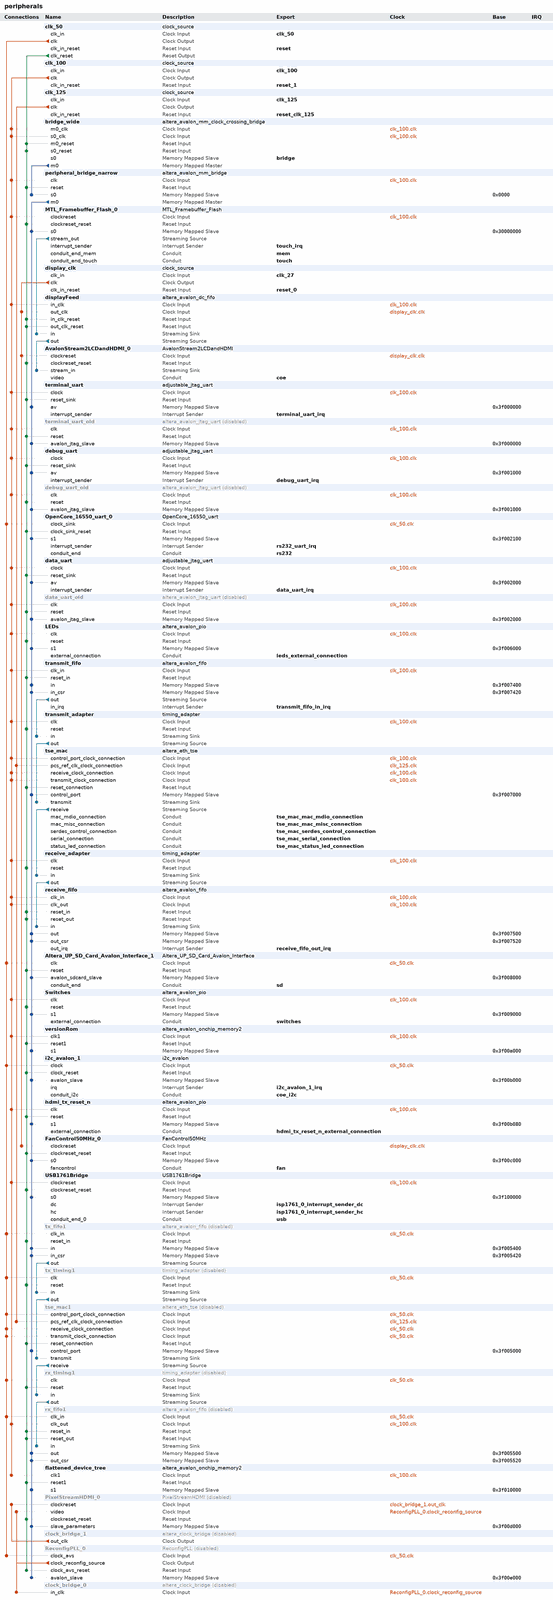
[diagram p0: system contents, whole]
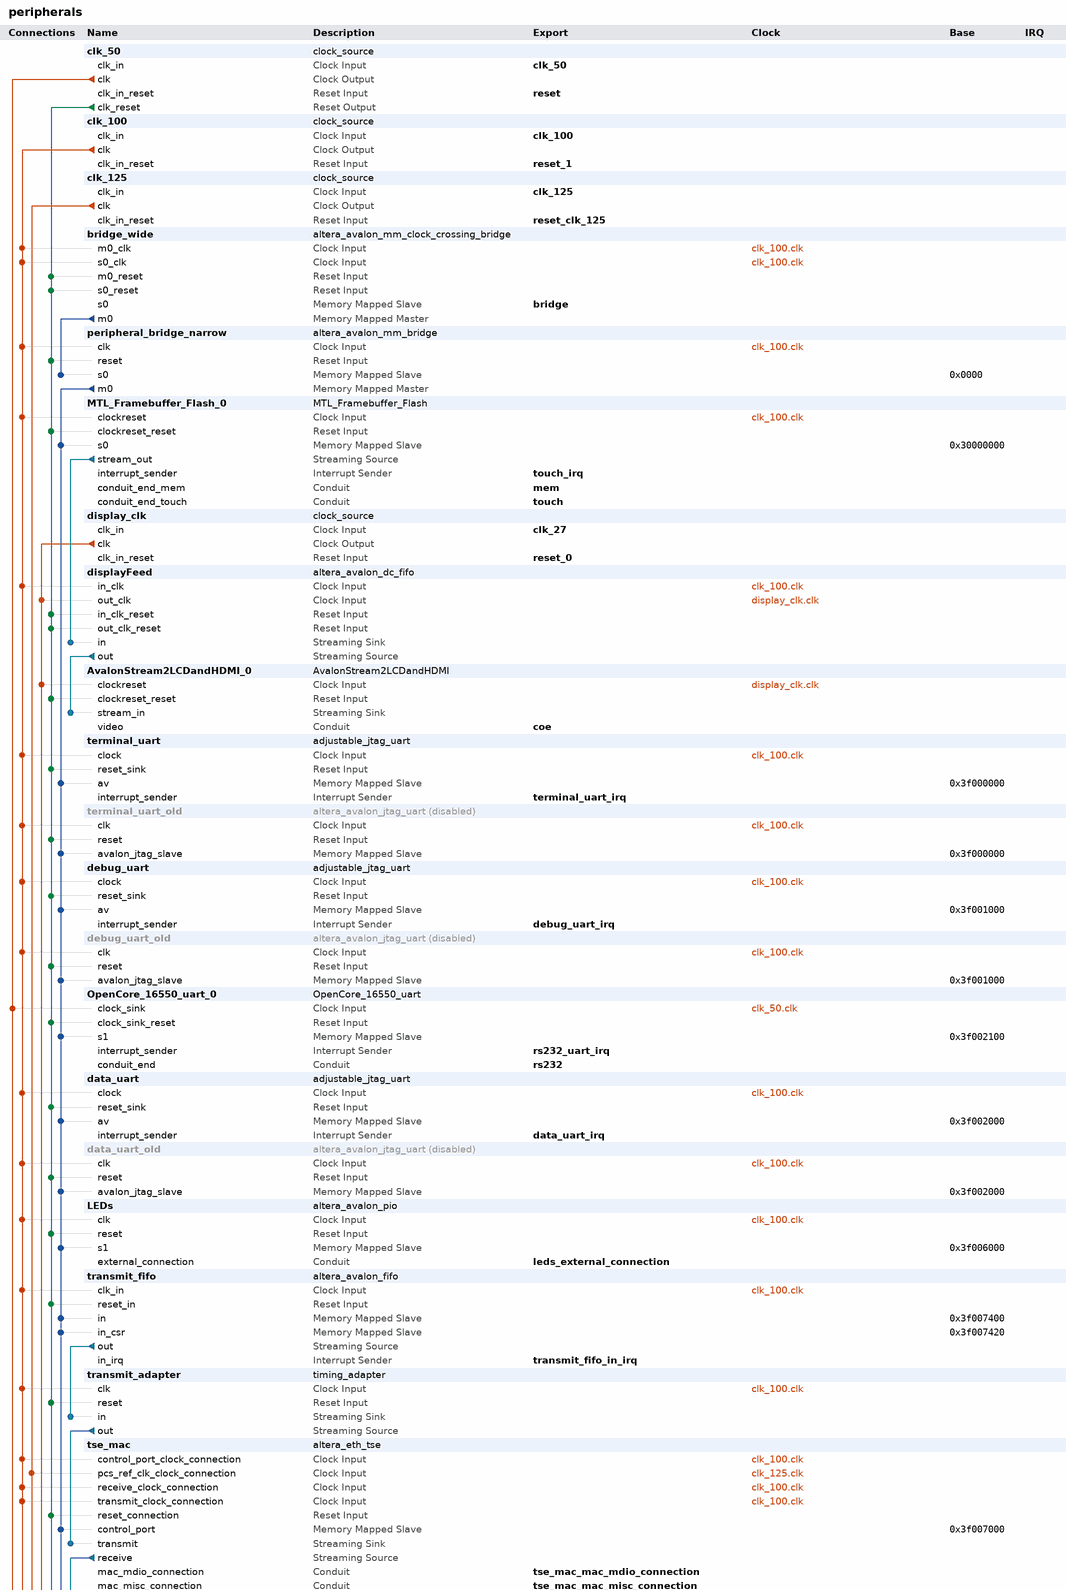
[diagram p1: system contents, upper part]
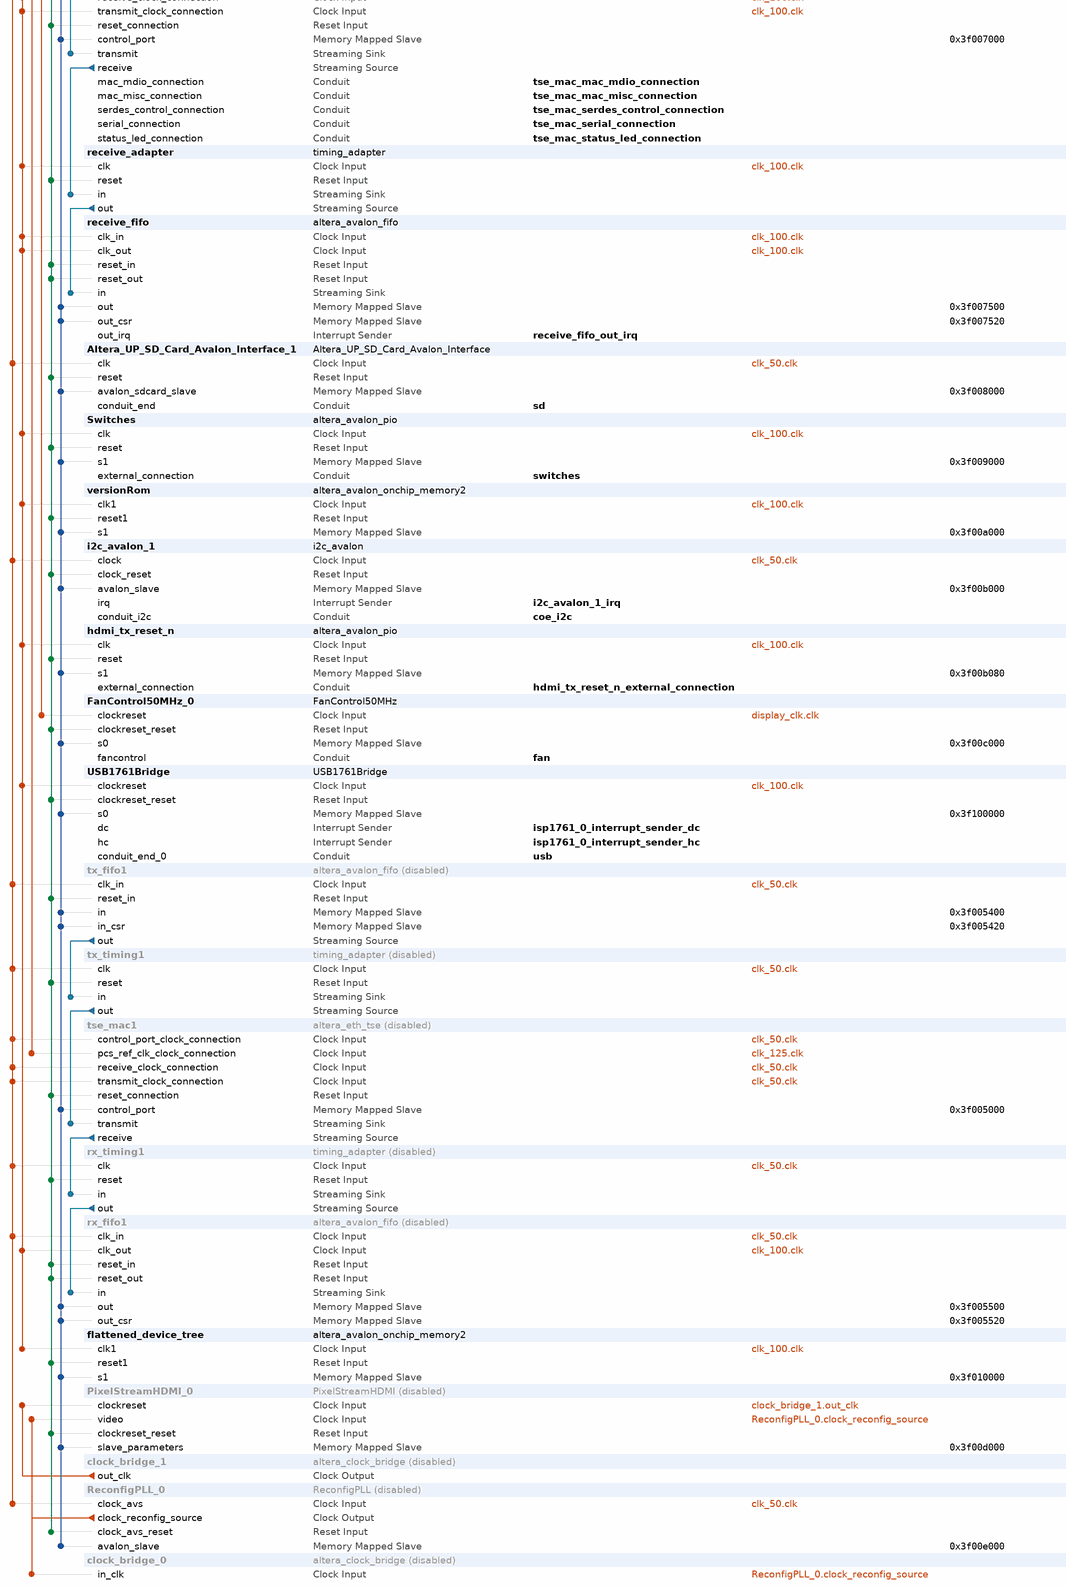
[diagram p2: system contents, lower part]
# Platform Designer (Qsys) system peripherals, Stratix IV EP4SGX230KF40C2
# Parameters at their usual value, and those the tool derives, are not listed.
package require -exact qsys 16.0
create_system peripherals
set_project_property DEVICE_FAMILY {Stratix IV}
set_project_property DEVICE EP4SGX230KF40C2

add_instance clk_50 clock_source 16.0
set_instance_parameter_value clk_50 clockFrequency 50000000

add_instance clk_100 clock_source 16.0
set_instance_parameter_value clk_100 clockFrequency 100000000

add_instance clk_125 clock_source 16.0
set_instance_parameter_value clk_125 clockFrequency 125000000

add_instance bridge_wide altera_avalon_mm_clock_crossing_bridge 16.0
set_instance_parameter_value bridge_wide ADDRESS_WIDTH 30
set_instance_parameter_value bridge_wide COMMAND_FIFO_DEPTH 4
set_instance_parameter_value bridge_wide DATA_WIDTH 256
set_instance_parameter_value bridge_wide MASTER_SYNC_DEPTH 2
set_instance_parameter_value bridge_wide MAX_BURST_SIZE 8
set_instance_parameter_value bridge_wide RESPONSE_FIFO_DEPTH 16
set_instance_parameter_value bridge_wide SLAVE_SYNC_DEPTH 2
set_instance_parameter_value bridge_wide USE_AUTO_ADDRESS_WIDTH 0

add_instance peripheral_bridge_narrow altera_avalon_mm_bridge 16.0
set_instance_parameter_value peripheral_bridge_narrow ADDRESS_UNITS SYMBOLS
set_instance_parameter_value peripheral_bridge_narrow ADDRESS_WIDTH 30
set_instance_parameter_value peripheral_bridge_narrow DATA_WIDTH 32
set_instance_parameter_value peripheral_bridge_narrow MAX_PENDING_RESPONSES 1
set_instance_parameter_value peripheral_bridge_narrow USE_AUTO_ADDRESS_WIDTH 0

add_instance MTL_Framebuffer_Flash_0 MTL_Framebuffer_Flash 1.0

add_instance display_clk clock_source 16.0
set_instance_parameter_value display_clk clockFrequency 27000000

add_instance displayFeed altera_avalon_dc_fifo 16.0
set_instance_parameter_value displayFeed BITS_PER_SYMBOL 24
set_instance_parameter_value displayFeed FIFO_DEPTH 32
set_instance_parameter_value displayFeed RD_SYNC_DEPTH 2
set_instance_parameter_value displayFeed USE_PACKETS 1
set_instance_parameter_value displayFeed WR_SYNC_DEPTH 2

add_instance AvalonStream2LCDandHDMI_0 AvalonStream2LCDandHDMI 1.0

add_instance terminal_uart adjustable_jtag_uart 13.1
set_instance_parameter_value terminal_uart INSTANCE_ID 1
set_instance_parameter_value terminal_uart LOG2_RXFIFO_DEPTH 9
set_instance_parameter_value terminal_uart LOG2_TXFIFO_DEPTH 12
set_instance_parameter_value terminal_uart SLD_AUTO_INSTANCE_INDEX NO

add_instance terminal_uart_old altera_avalon_jtag_uart 16.0
set_instance_property terminal_uart_old ENABLED false
set_instance_parameter_value terminal_uart_old readBufferDepth 4096
set_instance_parameter_value terminal_uart_old simInteractiveOptions INTERACTIVE_ASCII_OUTPUT
set_instance_parameter_value terminal_uart_old writeBufferDepth 512

add_instance debug_uart adjustable_jtag_uart 13.1
set_instance_parameter_value debug_uart INSTANCE_ID 2
set_instance_parameter_value debug_uart LOG2_RXFIFO_DEPTH 9
set_instance_parameter_value debug_uart LOG2_TXFIFO_DEPTH 12
set_instance_parameter_value debug_uart SLD_AUTO_INSTANCE_INDEX NO

add_instance debug_uart_old altera_avalon_jtag_uart 16.0
set_instance_property debug_uart_old ENABLED false
set_instance_parameter_value debug_uart_old readBufferDepth 4096
set_instance_parameter_value debug_uart_old simInteractiveOptions INTERACTIVE_ASCII_OUTPUT
set_instance_parameter_value debug_uart_old writeBufferDepth 512

add_instance OpenCore_16550_uart_0 OpenCore_16550_uart 12.1

add_instance data_uart adjustable_jtag_uart 13.1
set_instance_parameter_value data_uart INSTANCE_ID 3
set_instance_parameter_value data_uart LOG2_RXFIFO_DEPTH 9
set_instance_parameter_value data_uart LOG2_TXFIFO_DEPTH 12
set_instance_parameter_value data_uart SLD_AUTO_INSTANCE_INDEX NO

add_instance data_uart_old altera_avalon_jtag_uart 16.0
set_instance_property data_uart_old ENABLED false
set_instance_parameter_value data_uart_old readBufferDepth 4096
set_instance_parameter_value data_uart_old simInteractiveOptions INTERACTIVE_ASCII_OUTPUT
set_instance_parameter_value data_uart_old writeBufferDepth 512

add_instance LEDs altera_avalon_pio 16.0
set_instance_parameter_value LEDs direction Output
set_instance_parameter_value LEDs width 8

add_instance transmit_fifo altera_avalon_fifo 16.0
set_instance_parameter_value transmit_fifo bitsPerSymbol 8
set_instance_parameter_value transmit_fifo channelWidth 0
set_instance_parameter_value transmit_fifo errorWidth 1
set_instance_parameter_value transmit_fifo fifoDepth 16
set_instance_parameter_value transmit_fifo fifoInputInterfaceOptions AVALONMM_WRITE
set_instance_parameter_value transmit_fifo fifoOutputInterfaceOptions AVALONST_SOURCE
set_instance_parameter_value transmit_fifo singleClockMode true
set_instance_parameter_value transmit_fifo symbolsPerBeat 4
set_instance_parameter_value transmit_fifo useIRQ true
set_instance_parameter_value transmit_fifo usePacket true
set_instance_parameter_value transmit_fifo useReadControl false

add_instance transmit_adapter timing_adapter 16.0
set_instance_parameter_value transmit_adapter inBitsPerSymbol 8
set_instance_parameter_value transmit_adapter inChannelWidth 0
set_instance_parameter_value transmit_adapter inErrorWidth 1
set_instance_parameter_value transmit_adapter inMaxChannel 0
set_instance_parameter_value transmit_adapter inReadyLatency 1
set_instance_parameter_value transmit_adapter inSymbolsPerBeat 4
set_instance_parameter_value transmit_adapter inUseEmptyPort YES
set_instance_parameter_value transmit_adapter inUsePackets true
set_instance_parameter_value transmit_adapter inUseReady true
set_instance_parameter_value transmit_adapter inUseValid true
set_instance_parameter_value transmit_adapter outReadyLatency 0
set_instance_parameter_value transmit_adapter outUseReady true
set_instance_parameter_value transmit_adapter outUseValid true

add_instance tse_mac altera_eth_tse 16.0
set_instance_parameter_value tse_mac core_variation MAC_PCS
set_instance_parameter_value tse_mac ena_hash true
set_instance_parameter_value tse_mac enable_gmii_loopback true
set_instance_parameter_value tse_mac enable_hd_logic true
set_instance_parameter_value tse_mac enable_mac_flow_ctrl true
set_instance_parameter_value tse_mac enable_mac_vlan true
set_instance_parameter_value tse_mac enable_magic_detect true
set_instance_parameter_value tse_mac enable_sgmii true
set_instance_parameter_value tse_mac enable_shift16 true
set_instance_parameter_value tse_mac enable_sup_addr true
set_instance_parameter_value tse_mac ext_stat_cnt_ena true
set_instance_parameter_value tse_mac ifGMII MII_GMII
set_instance_parameter_value tse_mac ing_addr 11
set_instance_parameter_value tse_mac mdio_clk_div 40
set_instance_parameter_value tse_mac phy_identifier 213975361
set_instance_parameter_value tse_mac stat_cnt_ena true
set_instance_parameter_value tse_mac transceiver_type LVDS_IO

add_instance receive_adapter timing_adapter 16.0
set_instance_parameter_value receive_adapter inBitsPerSymbol 8
set_instance_parameter_value receive_adapter inChannelWidth 0
set_instance_parameter_value receive_adapter inErrorWidth 6
set_instance_parameter_value receive_adapter inMaxChannel 0
set_instance_parameter_value receive_adapter inReadyLatency 0
set_instance_parameter_value receive_adapter inSymbolsPerBeat 4
set_instance_parameter_value receive_adapter inUseEmptyPort YES
set_instance_parameter_value receive_adapter inUsePackets true
set_instance_parameter_value receive_adapter inUseReady true
set_instance_parameter_value receive_adapter inUseValid true
set_instance_parameter_value receive_adapter outReadyLatency 1
set_instance_parameter_value receive_adapter outUseReady true
set_instance_parameter_value receive_adapter outUseValid true

add_instance receive_fifo altera_avalon_fifo 16.0
set_instance_parameter_value receive_fifo bitsPerSymbol 8
set_instance_parameter_value receive_fifo channelWidth 0
set_instance_parameter_value receive_fifo errorWidth 6
set_instance_parameter_value receive_fifo fifoDepth 16
set_instance_parameter_value receive_fifo fifoInputInterfaceOptions AVALONST_SINK
set_instance_parameter_value receive_fifo fifoOutputInterfaceOptions AVALONMM_READ
set_instance_parameter_value receive_fifo singleClockMode false
set_instance_parameter_value receive_fifo symbolsPerBeat 4
set_instance_parameter_value receive_fifo useIRQ true
set_instance_parameter_value receive_fifo usePacket true
set_instance_parameter_value receive_fifo useReadControl true
set_instance_parameter_value receive_fifo useWriteControl false

add_instance Altera_UP_SD_Card_Avalon_Interface_1 Altera_UP_SD_Card_Avalon_Interface 15.1

add_instance Switches altera_avalon_pio 16.0
set_instance_parameter_value Switches direction Input
set_instance_parameter_value Switches width 16

add_instance versionRom altera_avalon_onchip_memory2 16.0
set_instance_parameter_value versionRom dataWidth 32
set_instance_parameter_value versionRom dualPort false
set_instance_parameter_value versionRom initMemContent true
set_instance_parameter_value versionRom initializationFileName version
set_instance_parameter_value versionRom memorySize 1024
set_instance_parameter_value versionRom useNonDefaultInitFile true
set_instance_parameter_value versionRom writable false

add_instance i2c_avalon_1 i2c_avalon 1.0

add_instance hdmi_tx_reset_n altera_avalon_pio 16.0
set_instance_parameter_value hdmi_tx_reset_n direction Output
set_instance_parameter_value hdmi_tx_reset_n width 1

add_instance FanControl50MHz_0 FanControl50MHz 1.0

add_instance USB1761Bridge USB1761Bridge 1.0

add_instance tx_fifo1 altera_avalon_fifo 16.0
set_instance_property tx_fifo1 ENABLED false
set_instance_parameter_value tx_fifo1 bitsPerSymbol 8
set_instance_parameter_value tx_fifo1 channelWidth 0
set_instance_parameter_value tx_fifo1 errorWidth 1
set_instance_parameter_value tx_fifo1 fifoDepth 16
set_instance_parameter_value tx_fifo1 fifoInputInterfaceOptions AVALONMM_WRITE
set_instance_parameter_value tx_fifo1 fifoOutputInterfaceOptions AVALONST_SOURCE
set_instance_parameter_value tx_fifo1 singleClockMode true
set_instance_parameter_value tx_fifo1 symbolsPerBeat 4
set_instance_parameter_value tx_fifo1 useIRQ true
set_instance_parameter_value tx_fifo1 usePacket true
set_instance_parameter_value tx_fifo1 useReadControl false

add_instance tx_timing1 timing_adapter 16.0
set_instance_property tx_timing1 ENABLED false
set_instance_parameter_value tx_timing1 inBitsPerSymbol 8
set_instance_parameter_value tx_timing1 inChannelWidth 0
set_instance_parameter_value tx_timing1 inErrorWidth 1
set_instance_parameter_value tx_timing1 inMaxChannel 0
set_instance_parameter_value tx_timing1 inReadyLatency 1
set_instance_parameter_value tx_timing1 inSymbolsPerBeat 4
set_instance_parameter_value tx_timing1 inUseEmptyPort YES
set_instance_parameter_value tx_timing1 inUsePackets true
set_instance_parameter_value tx_timing1 inUseReady true
set_instance_parameter_value tx_timing1 inUseValid true
set_instance_parameter_value tx_timing1 outReadyLatency 0
set_instance_parameter_value tx_timing1 outUseReady true
set_instance_parameter_value tx_timing1 outUseValid true

add_instance tse_mac1 altera_eth_tse 16.0
set_instance_property tse_mac1 ENABLED false
set_instance_parameter_value tse_mac1 core_variation MAC_PCS
set_instance_parameter_value tse_mac1 ena_hash true
set_instance_parameter_value tse_mac1 enable_gmii_loopback true
set_instance_parameter_value tse_mac1 enable_hd_logic true
set_instance_parameter_value tse_mac1 enable_mac_flow_ctrl true
set_instance_parameter_value tse_mac1 enable_mac_vlan true
set_instance_parameter_value tse_mac1 enable_magic_detect true
set_instance_parameter_value tse_mac1 enable_sgmii true
set_instance_parameter_value tse_mac1 enable_shift16 true
set_instance_parameter_value tse_mac1 enable_sup_addr true
set_instance_parameter_value tse_mac1 ext_stat_cnt_ena true
set_instance_parameter_value tse_mac1 ifGMII MII_GMII
set_instance_parameter_value tse_mac1 ing_addr 11
set_instance_parameter_value tse_mac1 mdio_clk_div 40
set_instance_parameter_value tse_mac1 phy_identifier 213975361
set_instance_parameter_value tse_mac1 stat_cnt_ena true
set_instance_parameter_value tse_mac1 transceiver_type LVDS_IO

add_instance rx_timing1 timing_adapter 16.0
set_instance_property rx_timing1 ENABLED false
set_instance_parameter_value rx_timing1 inBitsPerSymbol 8
set_instance_parameter_value rx_timing1 inChannelWidth 0
set_instance_parameter_value rx_timing1 inErrorWidth 6
set_instance_parameter_value rx_timing1 inMaxChannel 0
set_instance_parameter_value rx_timing1 inReadyLatency 0
set_instance_parameter_value rx_timing1 inSymbolsPerBeat 4
set_instance_parameter_value rx_timing1 inUseEmptyPort YES
set_instance_parameter_value rx_timing1 inUsePackets true
set_instance_parameter_value rx_timing1 inUseReady true
set_instance_parameter_value rx_timing1 inUseValid true
set_instance_parameter_value rx_timing1 outReadyLatency 1
set_instance_parameter_value rx_timing1 outUseReady true
set_instance_parameter_value rx_timing1 outUseValid true

add_instance rx_fifo1 altera_avalon_fifo 16.0
set_instance_property rx_fifo1 ENABLED false
set_instance_parameter_value rx_fifo1 bitsPerSymbol 8
set_instance_parameter_value rx_fifo1 channelWidth 0
set_instance_parameter_value rx_fifo1 errorWidth 6
set_instance_parameter_value rx_fifo1 fifoDepth 16
set_instance_parameter_value rx_fifo1 fifoInputInterfaceOptions AVALONST_SINK
set_instance_parameter_value rx_fifo1 fifoOutputInterfaceOptions AVALONMM_READ
set_instance_parameter_value rx_fifo1 singleClockMode false
set_instance_parameter_value rx_fifo1 symbolsPerBeat 4
set_instance_parameter_value rx_fifo1 useIRQ true
set_instance_parameter_value rx_fifo1 usePacket true
set_instance_parameter_value rx_fifo1 useReadControl true
set_instance_parameter_value rx_fifo1 useWriteControl false

add_instance flattened_device_tree altera_avalon_onchip_memory2 16.0
set_instance_parameter_value flattened_device_tree dataWidth 32
set_instance_parameter_value flattened_device_tree dualPort false
set_instance_parameter_value flattened_device_tree initMemContent true
set_instance_parameter_value flattened_device_tree initializationFileName dtb.hex
set_instance_parameter_value flattened_device_tree memorySize 8192
set_instance_parameter_value flattened_device_tree slave1Latency 2
set_instance_parameter_value flattened_device_tree useNonDefaultInitFile true
set_instance_parameter_value flattened_device_tree writable false

add_instance PixelStreamHDMI_0 PixelStreamHDMI 1.0
set_instance_property PixelStreamHDMI_0 ENABLED false

add_instance clock_bridge_1 altera_clock_bridge 16.0
set_instance_property clock_bridge_1 ENABLED false
set_instance_parameter_value clock_bridge_1 DERIVED_CLOCK_RATE 0
set_instance_parameter_value clock_bridge_1 EXPLICIT_CLOCK_RATE 0

add_instance ReconfigPLL_0 ReconfigPLL 1.0
set_instance_property ReconfigPLL_0 ENABLED false

add_instance clock_bridge_0 altera_clock_bridge 16.0
set_instance_property clock_bridge_0 ENABLED false
set_instance_parameter_value clock_bridge_0 DERIVED_CLOCK_RATE 0
set_instance_parameter_value clock_bridge_0 EXPLICIT_CLOCK_RATE 0

# connections
add_connection clk_50.clk Altera_UP_SD_Card_Avalon_Interface_1.clk clock
add_connection clk_50.clk i2c_avalon_1.clock clock
add_connection clk_50.clk OpenCore_16550_uart_0.clock_sink clock
add_connection clk_50.clk ReconfigPLL_0.clock_avs clock
add_connection clk_50.clk rx_fifo1.clk_in clock
add_connection clk_50.clk rx_timing1.clk clock
add_connection clk_50.clk tse_mac1.control_port_clock_connection clock
add_connection clk_50.clk tse_mac1.receive_clock_connection clock
add_connection clk_50.clk tse_mac1.transmit_clock_connection clock
add_connection clk_50.clk tx_fifo1.clk_in clock
add_connection clk_50.clk tx_timing1.clk clock
add_connection clk_100.clk bridge_wide.m0_clk clock
add_connection clk_100.clk bridge_wide.s0_clk clock
add_connection clk_100.clk data_uart.clock clock
add_connection clk_100.clk data_uart_old.clk clock
add_connection clk_100.clk debug_uart.clock clock
add_connection clk_100.clk debug_uart_old.clk clock
add_connection clk_100.clk displayFeed.in_clk clock
add_connection clk_100.clk flattened_device_tree.clk1 clock
add_connection clk_100.clk hdmi_tx_reset_n.clk clock
add_connection clk_100.clk LEDs.clk clock
add_connection clk_100.clk MTL_Framebuffer_Flash_0.clockreset clock
add_connection clk_100.clk peripheral_bridge_narrow.clk clock
add_connection clk_100.clk receive_adapter.clk clock
add_connection clk_100.clk receive_fifo.clk_in clock
add_connection clk_100.clk receive_fifo.clk_out clock
add_connection clk_100.clk rx_fifo1.clk_out clock
add_connection clk_100.clk Switches.clk clock
add_connection clk_100.clk terminal_uart.clock clock
add_connection clk_100.clk terminal_uart_old.clk clock
add_connection clk_100.clk transmit_adapter.clk clock
add_connection clk_100.clk transmit_fifo.clk_in clock
add_connection clk_100.clk tse_mac.control_port_clock_connection clock
add_connection clk_100.clk tse_mac.receive_clock_connection clock
add_connection clk_100.clk tse_mac.transmit_clock_connection clock
add_connection clk_100.clk USB1761Bridge.clockreset clock
add_connection clk_100.clk versionRom.clk1 clock
add_connection clk_125.clk tse_mac1.pcs_ref_clk_clock_connection clock
add_connection clk_125.clk tse_mac.pcs_ref_clk_clock_connection clock
add_connection clock_bridge_1.out_clk PixelStreamHDMI_0.clockreset clock
add_connection display_clk.clk AvalonStream2LCDandHDMI_0.clockreset clock
add_connection display_clk.clk displayFeed.out_clk clock
add_connection display_clk.clk FanControl50MHz_0.clockreset clock
add_connection ReconfigPLL_0.clock_reconfig_source clock_bridge_0.in_clk clock
add_connection ReconfigPLL_0.clock_reconfig_source PixelStreamHDMI_0.video clock
add_connection clk_50.clk_reset Altera_UP_SD_Card_Avalon_Interface_1.reset reset
add_connection clk_50.clk_reset AvalonStream2LCDandHDMI_0.clockreset_reset reset
add_connection clk_50.clk_reset bridge_wide.m0_reset reset
add_connection clk_50.clk_reset bridge_wide.s0_reset reset
add_connection clk_50.clk_reset data_uart.reset_sink reset
add_connection clk_50.clk_reset data_uart_old.reset reset
add_connection clk_50.clk_reset debug_uart.reset_sink reset
add_connection clk_50.clk_reset debug_uart_old.reset reset
add_connection clk_50.clk_reset displayFeed.in_clk_reset reset
add_connection clk_50.clk_reset displayFeed.out_clk_reset reset
add_connection clk_50.clk_reset FanControl50MHz_0.clockreset_reset reset
add_connection clk_50.clk_reset flattened_device_tree.reset1 reset
add_connection clk_50.clk_reset hdmi_tx_reset_n.reset reset
add_connection clk_50.clk_reset i2c_avalon_1.clock_reset reset
add_connection clk_50.clk_reset LEDs.reset reset
add_connection clk_50.clk_reset MTL_Framebuffer_Flash_0.clockreset_reset reset
add_connection clk_50.clk_reset OpenCore_16550_uart_0.clock_sink_reset reset
add_connection clk_50.clk_reset peripheral_bridge_narrow.reset reset
add_connection clk_50.clk_reset PixelStreamHDMI_0.clockreset_reset reset
add_connection clk_50.clk_reset receive_adapter.reset reset
add_connection clk_50.clk_reset receive_fifo.reset_in reset
add_connection clk_50.clk_reset receive_fifo.reset_out reset
add_connection clk_50.clk_reset ReconfigPLL_0.clock_avs_reset reset
add_connection clk_50.clk_reset rx_fifo1.reset_in reset
add_connection clk_50.clk_reset rx_fifo1.reset_out reset
add_connection clk_50.clk_reset rx_timing1.reset reset
add_connection clk_50.clk_reset Switches.reset reset
add_connection clk_50.clk_reset terminal_uart.reset_sink reset
add_connection clk_50.clk_reset terminal_uart_old.reset reset
add_connection clk_50.clk_reset transmit_adapter.reset reset
add_connection clk_50.clk_reset transmit_fifo.reset_in reset
add_connection clk_50.clk_reset tse_mac1.reset_connection reset
add_connection clk_50.clk_reset tse_mac.reset_connection reset
add_connection clk_50.clk_reset tx_fifo1.reset_in reset
add_connection clk_50.clk_reset tx_timing1.reset reset
add_connection clk_50.clk_reset USB1761Bridge.clockreset_reset reset
add_connection clk_50.clk_reset versionRom.reset1 reset
add_connection bridge_wide.m0 peripheral_bridge_narrow.s0 avalon
set_connection_parameter_value bridge_wide.m0/peripheral_bridge_narrow.s0 baseAddress 0x0000
add_connection peripheral_bridge_narrow.m0 Altera_UP_SD_Card_Avalon_Interface_1.avalon_sdcard_slave avalon
set_connection_parameter_value peripheral_bridge_narrow.m0/Altera_UP_SD_Card_Avalon_Interface_1.avalon_sdcard_slave baseAddress 0x3f008000
add_connection peripheral_bridge_narrow.m0 data_uart.av avalon
set_connection_parameter_value peripheral_bridge_narrow.m0/data_uart.av baseAddress 0x3f002000
add_connection peripheral_bridge_narrow.m0 data_uart_old.avalon_jtag_slave avalon
set_connection_parameter_value peripheral_bridge_narrow.m0/data_uart_old.avalon_jtag_slave baseAddress 0x3f002000
add_connection peripheral_bridge_narrow.m0 debug_uart.av avalon
set_connection_parameter_value peripheral_bridge_narrow.m0/debug_uart.av baseAddress 0x3f001000
add_connection peripheral_bridge_narrow.m0 debug_uart_old.avalon_jtag_slave avalon
set_connection_parameter_value peripheral_bridge_narrow.m0/debug_uart_old.avalon_jtag_slave baseAddress 0x3f001000
add_connection peripheral_bridge_narrow.m0 FanControl50MHz_0.s0 avalon
set_connection_parameter_value peripheral_bridge_narrow.m0/FanControl50MHz_0.s0 baseAddress 0x3f00c000
add_connection peripheral_bridge_narrow.m0 flattened_device_tree.s1 avalon
set_connection_parameter_value peripheral_bridge_narrow.m0/flattened_device_tree.s1 baseAddress 0x3f010000
add_connection peripheral_bridge_narrow.m0 hdmi_tx_reset_n.s1 avalon
set_connection_parameter_value peripheral_bridge_narrow.m0/hdmi_tx_reset_n.s1 baseAddress 0x3f00b080
add_connection peripheral_bridge_narrow.m0 i2c_avalon_1.avalon_slave avalon
set_connection_parameter_value peripheral_bridge_narrow.m0/i2c_avalon_1.avalon_slave baseAddress 0x3f00b000
add_connection peripheral_bridge_narrow.m0 LEDs.s1 avalon
set_connection_parameter_value peripheral_bridge_narrow.m0/LEDs.s1 baseAddress 0x3f006000
add_connection peripheral_bridge_narrow.m0 MTL_Framebuffer_Flash_0.s0 avalon
set_connection_parameter_value peripheral_bridge_narrow.m0/MTL_Framebuffer_Flash_0.s0 baseAddress 0x30000000
add_connection peripheral_bridge_narrow.m0 OpenCore_16550_uart_0.s1 avalon
set_connection_parameter_value peripheral_bridge_narrow.m0/OpenCore_16550_uart_0.s1 baseAddress 0x3f002100
add_connection peripheral_bridge_narrow.m0 PixelStreamHDMI_0.slave_parameters avalon
set_connection_parameter_value peripheral_bridge_narrow.m0/PixelStreamHDMI_0.slave_parameters baseAddress 0x3f00d000
add_connection peripheral_bridge_narrow.m0 receive_fifo.out avalon
set_connection_parameter_value peripheral_bridge_narrow.m0/receive_fifo.out baseAddress 0x3f007500
add_connection peripheral_bridge_narrow.m0 receive_fifo.out_csr avalon
set_connection_parameter_value peripheral_bridge_narrow.m0/receive_fifo.out_csr baseAddress 0x3f007520
add_connection peripheral_bridge_narrow.m0 ReconfigPLL_0.avalon_slave avalon
set_connection_parameter_value peripheral_bridge_narrow.m0/ReconfigPLL_0.avalon_slave baseAddress 0x3f00e000
add_connection peripheral_bridge_narrow.m0 rx_fifo1.out avalon
set_connection_parameter_value peripheral_bridge_narrow.m0/rx_fifo1.out baseAddress 0x3f005500
add_connection peripheral_bridge_narrow.m0 rx_fifo1.out_csr avalon
set_connection_parameter_value peripheral_bridge_narrow.m0/rx_fifo1.out_csr baseAddress 0x3f005520
add_connection peripheral_bridge_narrow.m0 Switches.s1 avalon
set_connection_parameter_value peripheral_bridge_narrow.m0/Switches.s1 baseAddress 0x3f009000
add_connection peripheral_bridge_narrow.m0 terminal_uart.av avalon
set_connection_parameter_value peripheral_bridge_narrow.m0/terminal_uart.av baseAddress 0x3f000000
add_connection peripheral_bridge_narrow.m0 terminal_uart_old.avalon_jtag_slave avalon
set_connection_parameter_value peripheral_bridge_narrow.m0/terminal_uart_old.avalon_jtag_slave baseAddress 0x3f000000
add_connection peripheral_bridge_narrow.m0 transmit_fifo.in avalon
set_connection_parameter_value peripheral_bridge_narrow.m0/transmit_fifo.in baseAddress 0x3f007400
add_connection peripheral_bridge_narrow.m0 transmit_fifo.in_csr avalon
set_connection_parameter_value peripheral_bridge_narrow.m0/transmit_fifo.in_csr baseAddress 0x3f007420
add_connection peripheral_bridge_narrow.m0 tse_mac1.control_port avalon
set_connection_parameter_value peripheral_bridge_narrow.m0/tse_mac1.control_port baseAddress 0x3f005000
add_connection peripheral_bridge_narrow.m0 tse_mac.control_port avalon
set_connection_parameter_value peripheral_bridge_narrow.m0/tse_mac.control_port baseAddress 0x3f007000
add_connection peripheral_bridge_narrow.m0 tx_fifo1.in avalon
set_connection_parameter_value peripheral_bridge_narrow.m0/tx_fifo1.in baseAddress 0x3f005400
add_connection peripheral_bridge_narrow.m0 tx_fifo1.in_csr avalon
set_connection_parameter_value peripheral_bridge_narrow.m0/tx_fifo1.in_csr baseAddress 0x3f005420
add_connection peripheral_bridge_narrow.m0 USB1761Bridge.s0 avalon
set_connection_parameter_value peripheral_bridge_narrow.m0/USB1761Bridge.s0 baseAddress 0x3f100000
add_connection peripheral_bridge_narrow.m0 versionRom.s1 avalon
set_connection_parameter_value peripheral_bridge_narrow.m0/versionRom.s1 baseAddress 0x3f00a000
add_connection displayFeed.out AvalonStream2LCDandHDMI_0.stream_in avalon_streaming
add_connection MTL_Framebuffer_Flash_0.stream_out displayFeed.in avalon_streaming
add_connection receive_adapter.out receive_fifo.in avalon_streaming
add_connection rx_timing1.out rx_fifo1.in avalon_streaming
add_connection transmit_adapter.out tse_mac.transmit avalon_streaming
add_connection transmit_fifo.out transmit_adapter.in avalon_streaming
add_connection tse_mac1.receive rx_timing1.in avalon_streaming
add_connection tse_mac.receive receive_adapter.in avalon_streaming
add_connection tx_fifo1.out tx_timing1.in avalon_streaming
add_connection tx_timing1.out tse_mac1.transmit avalon_streaming

# exported interfaces
add_interface bridge avalon slave
set_interface_property bridge EXPORT_OF bridge_wide.s0
add_interface clk_100 clock sink
set_interface_property clk_100 EXPORT_OF clk_100.clk_in
add_interface clk_125 clock sink
set_interface_property clk_125 EXPORT_OF clk_125.clk_in
add_interface clk_27 clock sink
set_interface_property clk_27 EXPORT_OF display_clk.clk_in
add_interface clk_50 clock sink
set_interface_property clk_50 EXPORT_OF clk_50.clk_in
add_interface coe conduit end
set_interface_property coe EXPORT_OF AvalonStream2LCDandHDMI_0.video
add_interface coe_i2c conduit end
set_interface_property coe_i2c EXPORT_OF i2c_avalon_1.conduit_i2c
add_interface data_uart_irq interrupt sender
set_interface_property data_uart_irq EXPORT_OF data_uart.interrupt_sender
add_interface debug_uart_irq interrupt sender
set_interface_property debug_uart_irq EXPORT_OF debug_uart.interrupt_sender
add_interface fan conduit end
set_interface_property fan EXPORT_OF FanControl50MHz_0.fancontrol
add_interface hdmi_tx_reset_n_external_connection conduit end
set_interface_property hdmi_tx_reset_n_external_connection EXPORT_OF hdmi_tx_reset_n.external_connection
add_interface i2c_avalon_1_irq interrupt sender
set_interface_property i2c_avalon_1_irq EXPORT_OF i2c_avalon_1.irq
add_interface isp1761_0_interrupt_sender_dc interrupt sender
set_interface_property isp1761_0_interrupt_sender_dc EXPORT_OF USB1761Bridge.dc
add_interface isp1761_0_interrupt_sender_hc interrupt sender
set_interface_property isp1761_0_interrupt_sender_hc EXPORT_OF USB1761Bridge.hc
add_interface leds_external_connection conduit end
set_interface_property leds_external_connection EXPORT_OF LEDs.external_connection
add_interface mem conduit end
set_interface_property mem EXPORT_OF MTL_Framebuffer_Flash_0.conduit_end_mem
add_interface receive_fifo_out_irq interrupt sender
set_interface_property receive_fifo_out_irq EXPORT_OF receive_fifo.out_irq
add_interface reset reset sink
set_interface_property reset EXPORT_OF clk_50.clk_in_reset
add_interface reset_0 reset sink
set_interface_property reset_0 EXPORT_OF display_clk.clk_in_reset
add_interface reset_1 reset sink
set_interface_property reset_1 EXPORT_OF clk_100.clk_in_reset
add_interface reset_clk_125 reset sink
set_interface_property reset_clk_125 EXPORT_OF clk_125.clk_in_reset
add_interface rs232 conduit end
set_interface_property rs232 EXPORT_OF OpenCore_16550_uart_0.conduit_end
add_interface rs232_uart_irq interrupt sender
set_interface_property rs232_uart_irq EXPORT_OF OpenCore_16550_uart_0.interrupt_sender
add_interface sd conduit end
set_interface_property sd EXPORT_OF Altera_UP_SD_Card_Avalon_Interface_1.conduit_end
add_interface switches conduit end
set_interface_property switches EXPORT_OF Switches.external_connection
add_interface terminal_uart_irq interrupt sender
set_interface_property terminal_uart_irq EXPORT_OF terminal_uart.interrupt_sender
add_interface touch conduit end
set_interface_property touch EXPORT_OF MTL_Framebuffer_Flash_0.conduit_end_touch
add_interface touch_irq interrupt sender
set_interface_property touch_irq EXPORT_OF MTL_Framebuffer_Flash_0.interrupt_sender
add_interface transmit_fifo_in_irq interrupt sender
set_interface_property transmit_fifo_in_irq EXPORT_OF transmit_fifo.in_irq
add_interface tse_mac_mac_mdio_connection conduit end
set_interface_property tse_mac_mac_mdio_connection EXPORT_OF tse_mac.mac_mdio_connection
add_interface tse_mac_mac_misc_connection conduit end
set_interface_property tse_mac_mac_misc_connection EXPORT_OF tse_mac.mac_misc_connection
add_interface tse_mac_serdes_control_connection conduit end
set_interface_property tse_mac_serdes_control_connection EXPORT_OF tse_mac.serdes_control_connection
add_interface tse_mac_serial_connection conduit end
set_interface_property tse_mac_serial_connection EXPORT_OF tse_mac.serial_connection
add_interface tse_mac_status_led_connection conduit end
set_interface_property tse_mac_status_led_connection EXPORT_OF tse_mac.status_led_connection
add_interface usb conduit end
set_interface_property usb EXPORT_OF USB1761Bridge.conduit_end_0

set_interconnect_requirement {$system} qsys_mm.clockCrossingAdapter AUTO
set_interconnect_requirement {$system} qsys_mm.maxAdditionalLatency 2

save_system peripherals.qsys
